# Altium schematic sheet stm32.SchDoc
size A4
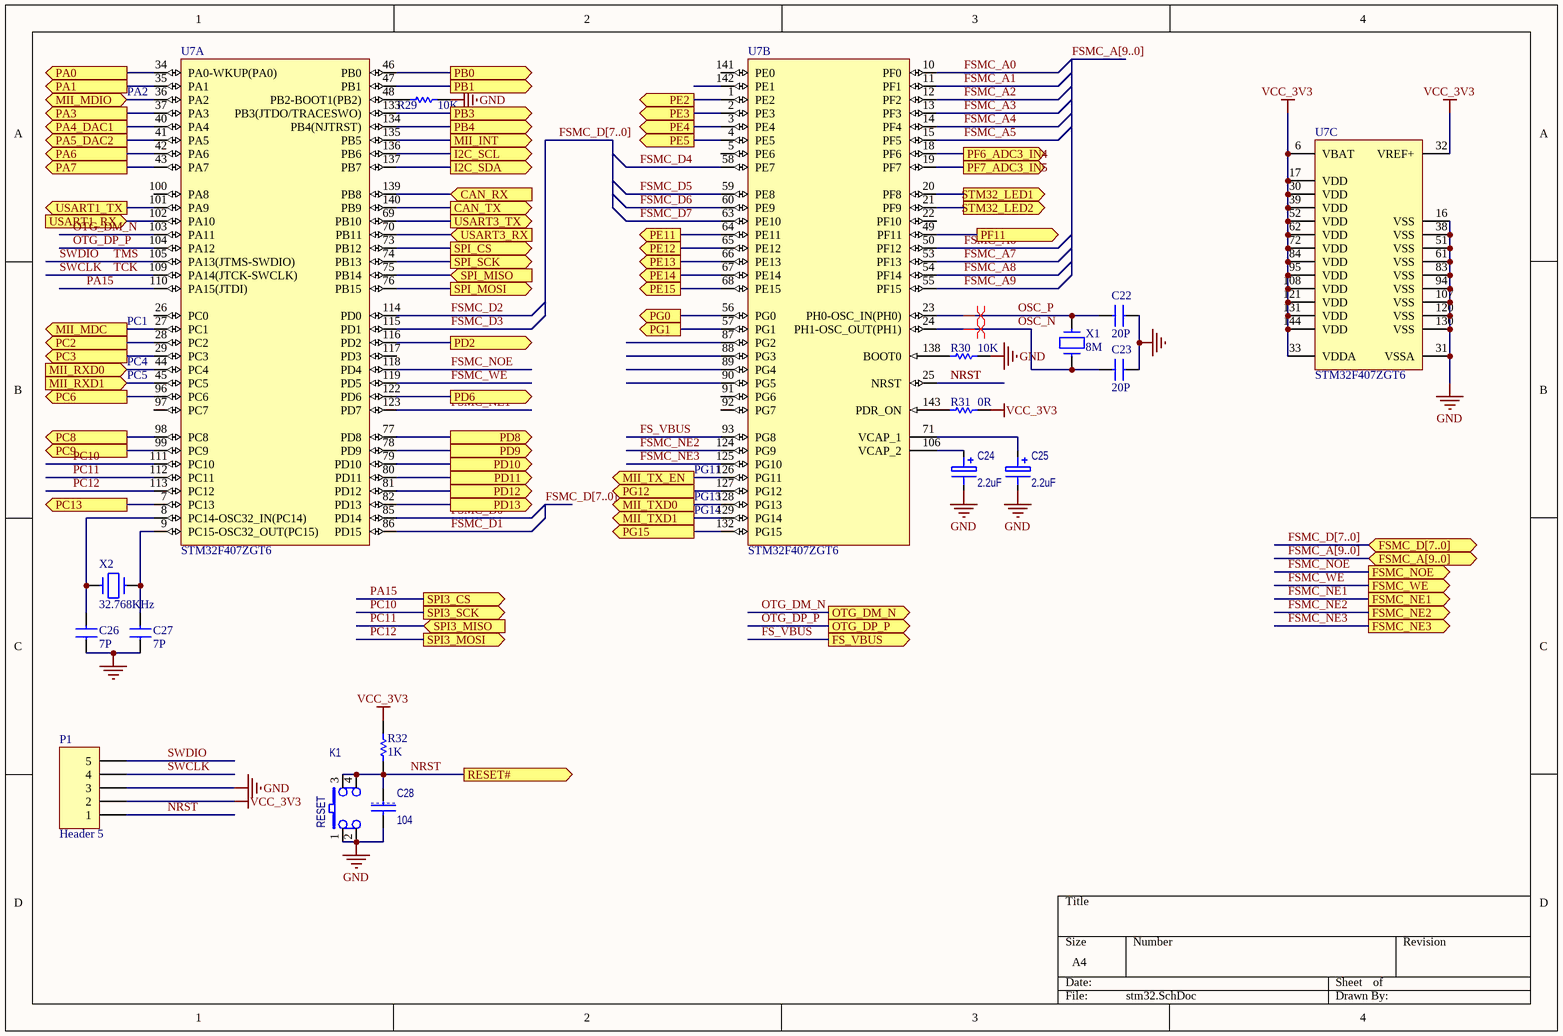
[diagram p0: stm32.SchDoc]

## Parts
C22  20P  [0603C]
C23  20P  [0603C]
C24  2.2uF  [3216]
C25  2.2uF  [3216]
C26  7P  [0603C]
C27  7P  [0603C]
C28  104  [0603C]
K1  RESET  [SW_PIN4]
P1  Header 5  [HDR1X5]
R29  10K  [0603R]
R30  10K  [0603R]
R31  value 0R  [0603R]  (hidden comment: 10K)
R32  1K  [0603R]
U7  STM32F407ZGT6  [STM-LQFP144_N]  (parts A,B,C of 3)
X1  8M  [XTAL3]
X2  32.768KHz  [XTAL2]

## Ports
CAN_RX (in), CAN_TX (out), FS_VBUS (out), FSMC_A[9..0] (bidir), FSMC_D[7..0] (bidir), FSMC_NE1 (out), FSMC_NE2 (out), FSMC_NE3 (out), FSMC_NOE (out), FSMC_WE (out), I2C_SCL (out), I2C_SDA (out), MII_INT (out), MII_MDC (out), MII_MDIO (bidir), MII_RXD0 (in), MII_RXD1 (in), MII_TX_EN (out), MII_TXD0 (out), MII_TXD1 (out), OTG_DM_N (out), OTG_DP_P (out), PA0 (out), PA1 (out), PA3 (out), PA4_DAC1 (out), PA5_DAC2 (out), PA6 (out), PA7 (out), PB0 (out), PB1 (out), PB3 (out), PB4 (out), PC2 (out), PC3 (out), PC6 (out), PC8 (out), PC9 (out), PC13 (out), PD2 (out), PD6 (out), PD8 (out), PD9 (out), PD10 (out), PD11 (out), PD12 (out), PD13 (out), PE2 (out), PE3 (out), PE4 (out), PE5 (out), PE11 (out), PE12 (out), PE13 (out), PE14 (out), PE15 (out), PF6_ADC3_IN4 (out), PF7_ADC3_IN5 (out), PF11 (out), PG0 (out), PG1 (out), PG12 (out), PG15 (out), RESET# (out), SPI3_CS (out), SPI3_MISO (in), SPI3_MOSI (out), SPI3_SCK (out), SPI_CS (out), SPI_MISO (in), SPI_MOSI (out), SPI_SCK (out), STM32_LED1 (out), STM32_LED2 (out), USART1_RX (in), USART1_TX (out), USART3_RX (in), USART3_TX (out)

## Nets
GND: C22.1 C23.1 C24.2 C25.2 C26.1 C27.1 C28.2 K1.1 K1.2 P1.3 R29.1 R30.2 U7.16(VSS) U7.31(VSSA) U7.38(VSS) U7.51(VSS) U7.61(VSS) U7.83(VSS) U7.94(VSS) U7.107(VSS) U7.120(VSS) U7.130(VSS)
VCC_3V3: P1.2 R31.2 R32.2 U7.6(VBAT) U7.17(VDD) U7.30(VDD) U7.32(VREF+) U7.33(VDDA) U7.39(VDD) U7.52(VDD) U7.62(VDD) U7.72(VDD) U7.84(VDD) U7.95(VDD) U7.108(VDD) U7.121(VDD) U7.131(VDD) U7.144(VDD)
CAN_RX: U7.139(PB8) ; port CAN_RX
CAN_TX: U7.140(PB9) ; port CAN_TX
FS_VBUS: U7.93(PG8) ; port FS_VBUS
FSMC_A0: U7.10(PF0)
FSMC_A1: U7.11(PF1)
FSMC_A2: U7.12(PF2)
FSMC_A3: U7.13(PF3)
FSMC_A4: U7.14(PF4)
FSMC_A5: U7.15(PF5)
FSMC_A6: U7.50(PF12)
FSMC_A7: U7.53(PF13)
FSMC_A8: U7.54(PF14)
FSMC_A9: U7.55(PF15)
FSMC_D0: U7.85(PD14)
FSMC_D1: U7.86(PD15)
FSMC_D2: U7.114(PD0)
FSMC_D3: U7.115(PD1)
FSMC_D4: U7.58(PE7)
FSMC_D5: U7.59(PE8)
FSMC_D6: U7.60(PE9)
FSMC_D7: U7.63(PE10)
FSMC_NE1: U7.123(PD7) ; port FSMC_NE1
FSMC_NE2: U7.124(PG9) ; port FSMC_NE2
FSMC_NE3: U7.125(PG10) ; port FSMC_NE3
FSMC_NOE: U7.118(PD4) ; port FSMC_NOE
FSMC_WE: U7.119(PD5) ; port FSMC_WE
I2C_SCL: U7.136(PB6) ; port I2C_SCL
I2C_SDA: U7.137(PB7) ; port I2C_SDA
MII_INT: U7.135(PB5) ; port MII_INT
MII_MDC: U7.27(PC1) ; port MII_MDC
MII_MDIO: U7.36(PA2) ; port MII_MDIO
MII_RXD0: U7.44(PC4) ; port MII_RXD0
MII_RXD1: U7.45(PC5) ; port MII_RXD1
MII_TX_EN: U7.126(PG11) ; port MII_TX_EN
MII_TXD0: U7.128(PG13) ; port MII_TXD0
MII_TXD1: U7.129(PG14) ; port MII_TXD1
NRST: C28.1 K1.3 K1.4 P1.1 R32.1 U7.25(NRST) ; port RESET#
OSC_N: C23.2 U7.24(PH1-OSC_OUT(PH1)) X1.2
OSC_P: C22.2 U7.23(PH0-OSC_IN(PH0)) X1.1
OTG_DM_N: U7.103(PA11) ; port OTG_DM_N
OTG_DP_P: U7.104(PA12) ; port OTG_DP_P
PA0: U7.34(PA0-WKUP(PA0)) ; port PA0
PA1: U7.35(PA1) ; port PA1
PA3: U7.37(PA3) ; port PA3
PA4_DAC1: U7.40(PA4) ; port PA4_DAC1
PA5_DAC2: U7.41(PA5) ; port PA5_DAC2
PA6: U7.42(PA6) ; port PA6
PA7: U7.43(PA7) ; port PA7
PA15: U7.110(PA15(JTDI)) ; port SPI3_CS
PB0: U7.46(PB0) ; port PB0
PB1: U7.47(PB1) ; port PB1
PB3: U7.133(PB3(JTDO/TRACESWO)) ; port PB3
PB4: U7.134(PB4(NJTRST)) ; port PB4
PC2: U7.28(PC2) ; port PC2
PC3: U7.29(PC3) ; port PC3
PC6: U7.96(PC6) ; port PC6
PC8: U7.98(PC8) ; port PC8
PC9: U7.99(PC9) ; port PC9
PC10: U7.111(PC10) ; port SPI3_SCK
PC11: U7.112(PC11) ; port SPI3_MISO
PC12: U7.113(PC12) ; port SPI3_MOSI
PC13: U7.7(PC13) ; port PC13
PD2: U7.116(PD2) ; port PD2
PD6: U7.122(PD6) ; port PD6
PD8: U7.77(PD8) ; port PD8
PD9: U7.78(PD9) ; port PD9
PD10: U7.79(PD10) ; port PD10
PD11: U7.80(PD11) ; port PD11
PD12: U7.81(PD12) ; port PD12
PD13: U7.82(PD13) ; port PD13
PE2: U7.1(PE2) ; port PE2
PE3: U7.2(PE3) ; port PE3
PE4: U7.3(PE4) ; port PE4
PE5: U7.4(PE5) ; port PE5
PE11: U7.64(PE11) ; port PE11
PE12: U7.65(PE12) ; port PE12
PE13: U7.66(PE13) ; port PE13
PE14: U7.67(PE14) ; port PE14
PE15: U7.68(PE15) ; port PE15
PF6_ADC3_IN4: U7.18(PF6) ; port PF6_ADC3_IN4
PF7_ADC3_IN5: U7.19(PF7) ; port PF7_ADC3_IN5
PF11: U7.49(PF11) ; port PF11
PG0: U7.56(PG0) ; port PG0
PG1: U7.57(PG1) ; port PG1
PG12: U7.127(PG12) ; port PG12
PG15: U7.132(PG15) ; port PG15
SPI_CS: U7.73(PB12) ; port SPI_CS
SPI_MISO: U7.75(PB14) ; port SPI_MISO
SPI_MOSI: U7.76(PB15) ; port SPI_MOSI
SPI_SCK: U7.74(PB13) ; port SPI_SCK
STM32_LED1: U7.20(PF8) ; port STM32_LED1
STM32_LED2: U7.21(PF9) ; port STM32_LED2
SWCLK: P1.4 U7.109(PA14(JTCK-SWCLK))  [also labelled TCK]
SWDIO: P1.5 U7.105(PA13(JTMS-SWDIO))  [also labelled TMS]
USART1_RX: U7.102(PA10) ; port USART1_RX
USART1_TX: U7.101(PA9) ; port USART1_TX
USART3_RX: U7.70(PB11) ; port USART3_RX
USART3_TX: U7.69(PB10) ; port USART3_TX
NetC24_1: C24.1 U7.106(VCAP_2)
NetC25_1: C25.1 U7.71(VCAP_1)
NetC26_2: C26.2 U7.8(PC14-OSC32_IN(PC14)) X2.2
NetC27_2: C27.2 U7.9(PC15-OSC32_OUT(PC15)) X2.1
NetR29_2: R29.2 U7.48(PB2-BOOT1(PB2))
NetR30_1: R30.1 U7.138(BOOT0)
NetR31_1: R31.1 U7.143(PDR_ON)

Not connected (* = marked no-connect by the designer): U7 5(PE6) 22(PF10) 26(PC0) 87(PG2) 88(PG3) 89(PG4) 90(PG5) 91(PG6) 92(PG7) 97(PC7) 100(PA8) 117(PD3) 141(PE0) 142(PE1)

## Buses and harness runs
bus FSMC_A[9..0]
bus FSMC_A[9..0] = port FSMC_A[9..0]
bus FSMC_D[7..0]
bus FSMC_D[7..0] = port FSMC_D[7..0]

## Layout directives
differential pair: OSC_N, OSC_P

## Notes on the sheet
- (near U7) PA2
- (near U7) PC4
- (near U7) PC5
- (near U7) PC1
- (near U7) PG11
- (near U7) PG13
- (near U7) PG14

## Library data of the parts
C22 C23 C26-C28 = CAP: Capacitor
  C22 C23 C26 C27: IC: *
C24 C25 = ELECTRO
K1 = SW_PUSH2: Text Field1: 30; Text Field2: 30
P1 = Header 5: Header, 5-Pin; LatestRevisionDate: 17-Jul-2002; LatestRevisionNote: Re-released for DXP Platform.; Publisher: Altium Limited
R29-R32 = Res Semi: Semiconductor Resistor; Published: 8-Jun-2000; LatestRevisionDate: 17-Jul-2002; LatestRevisionNote: Re-released for DXP Platform.; PackageReference: AXIAL-0.5; Publisher: Altium Limited; PackageDescription: Axial Device, Thru-Hole; 2 Leads; 0.5 in Pin Spacing
  R29 R30: Value: 10K
  R32: Value: 1K
U7 = STM32F407ZGT6: ARM Cortex-M4 32-bit MCU+FPU, 210 DMIPS, 1024 kB Flash, 192 kB Internal RAM, 114 I/Os, 144-pin LQFP, -40 to 85 degC, Tray; Manufacturer: STMicroelectronics; D/A Converter: 2x12-bit; FLASH Size (Prog) (kB): 1024; I/Os (High Current): 114; Internal RAM Size (kB): 192; Operating Frequency(F) (Processor speed) (MHz): 168; Supply Voltage(Vcc) max (V): 3.6; Supply Voltage(Vcc) min (V): 1.8; DatasheetVersion: Rev. 4; PackageVersion: Rev. 4, 06/2013; PackageReference: LQFP144; PackageDescription: 144-Pin Low Profile Quad Flat Package, 20 x 20 mm Body, 0.5 mm Pitch; Supplier 1: Digi-Key; Supplier Part Number 1: 497-11766-ND; Supplier 2: Newark; Supplier Part Number 2: 73T2334; Supplier 3: Mouser; Supplier Part Number 3: 511-STM32F407ZGT6; Core: ARM Cortex-M4; Packing: Tray; Mounting Technology: Surface Mount; PartNumber: STM32F407ZGT6; ComponentLink1Description: Manufacturer URL; ComponentLink1URL: http://www.st.com/web/en/home.html; ComponentLink2Description: Datasheet; ComponentLink2URL: http://www.st.com/st-web-ui/static/active/en/resource/technical/document/datasheet/DM00037051.pdf; ComponentLink3Description: Package Specification; ComponentLink3URL: http://www.st.com/st-web-ui/static/active/en/resource/technical/document/datasheet/DM00037051.pdf
X1 X2 = CRYSTAL